# EAGLE design cheetah_driver_2 (EAGLE 6.5.0)
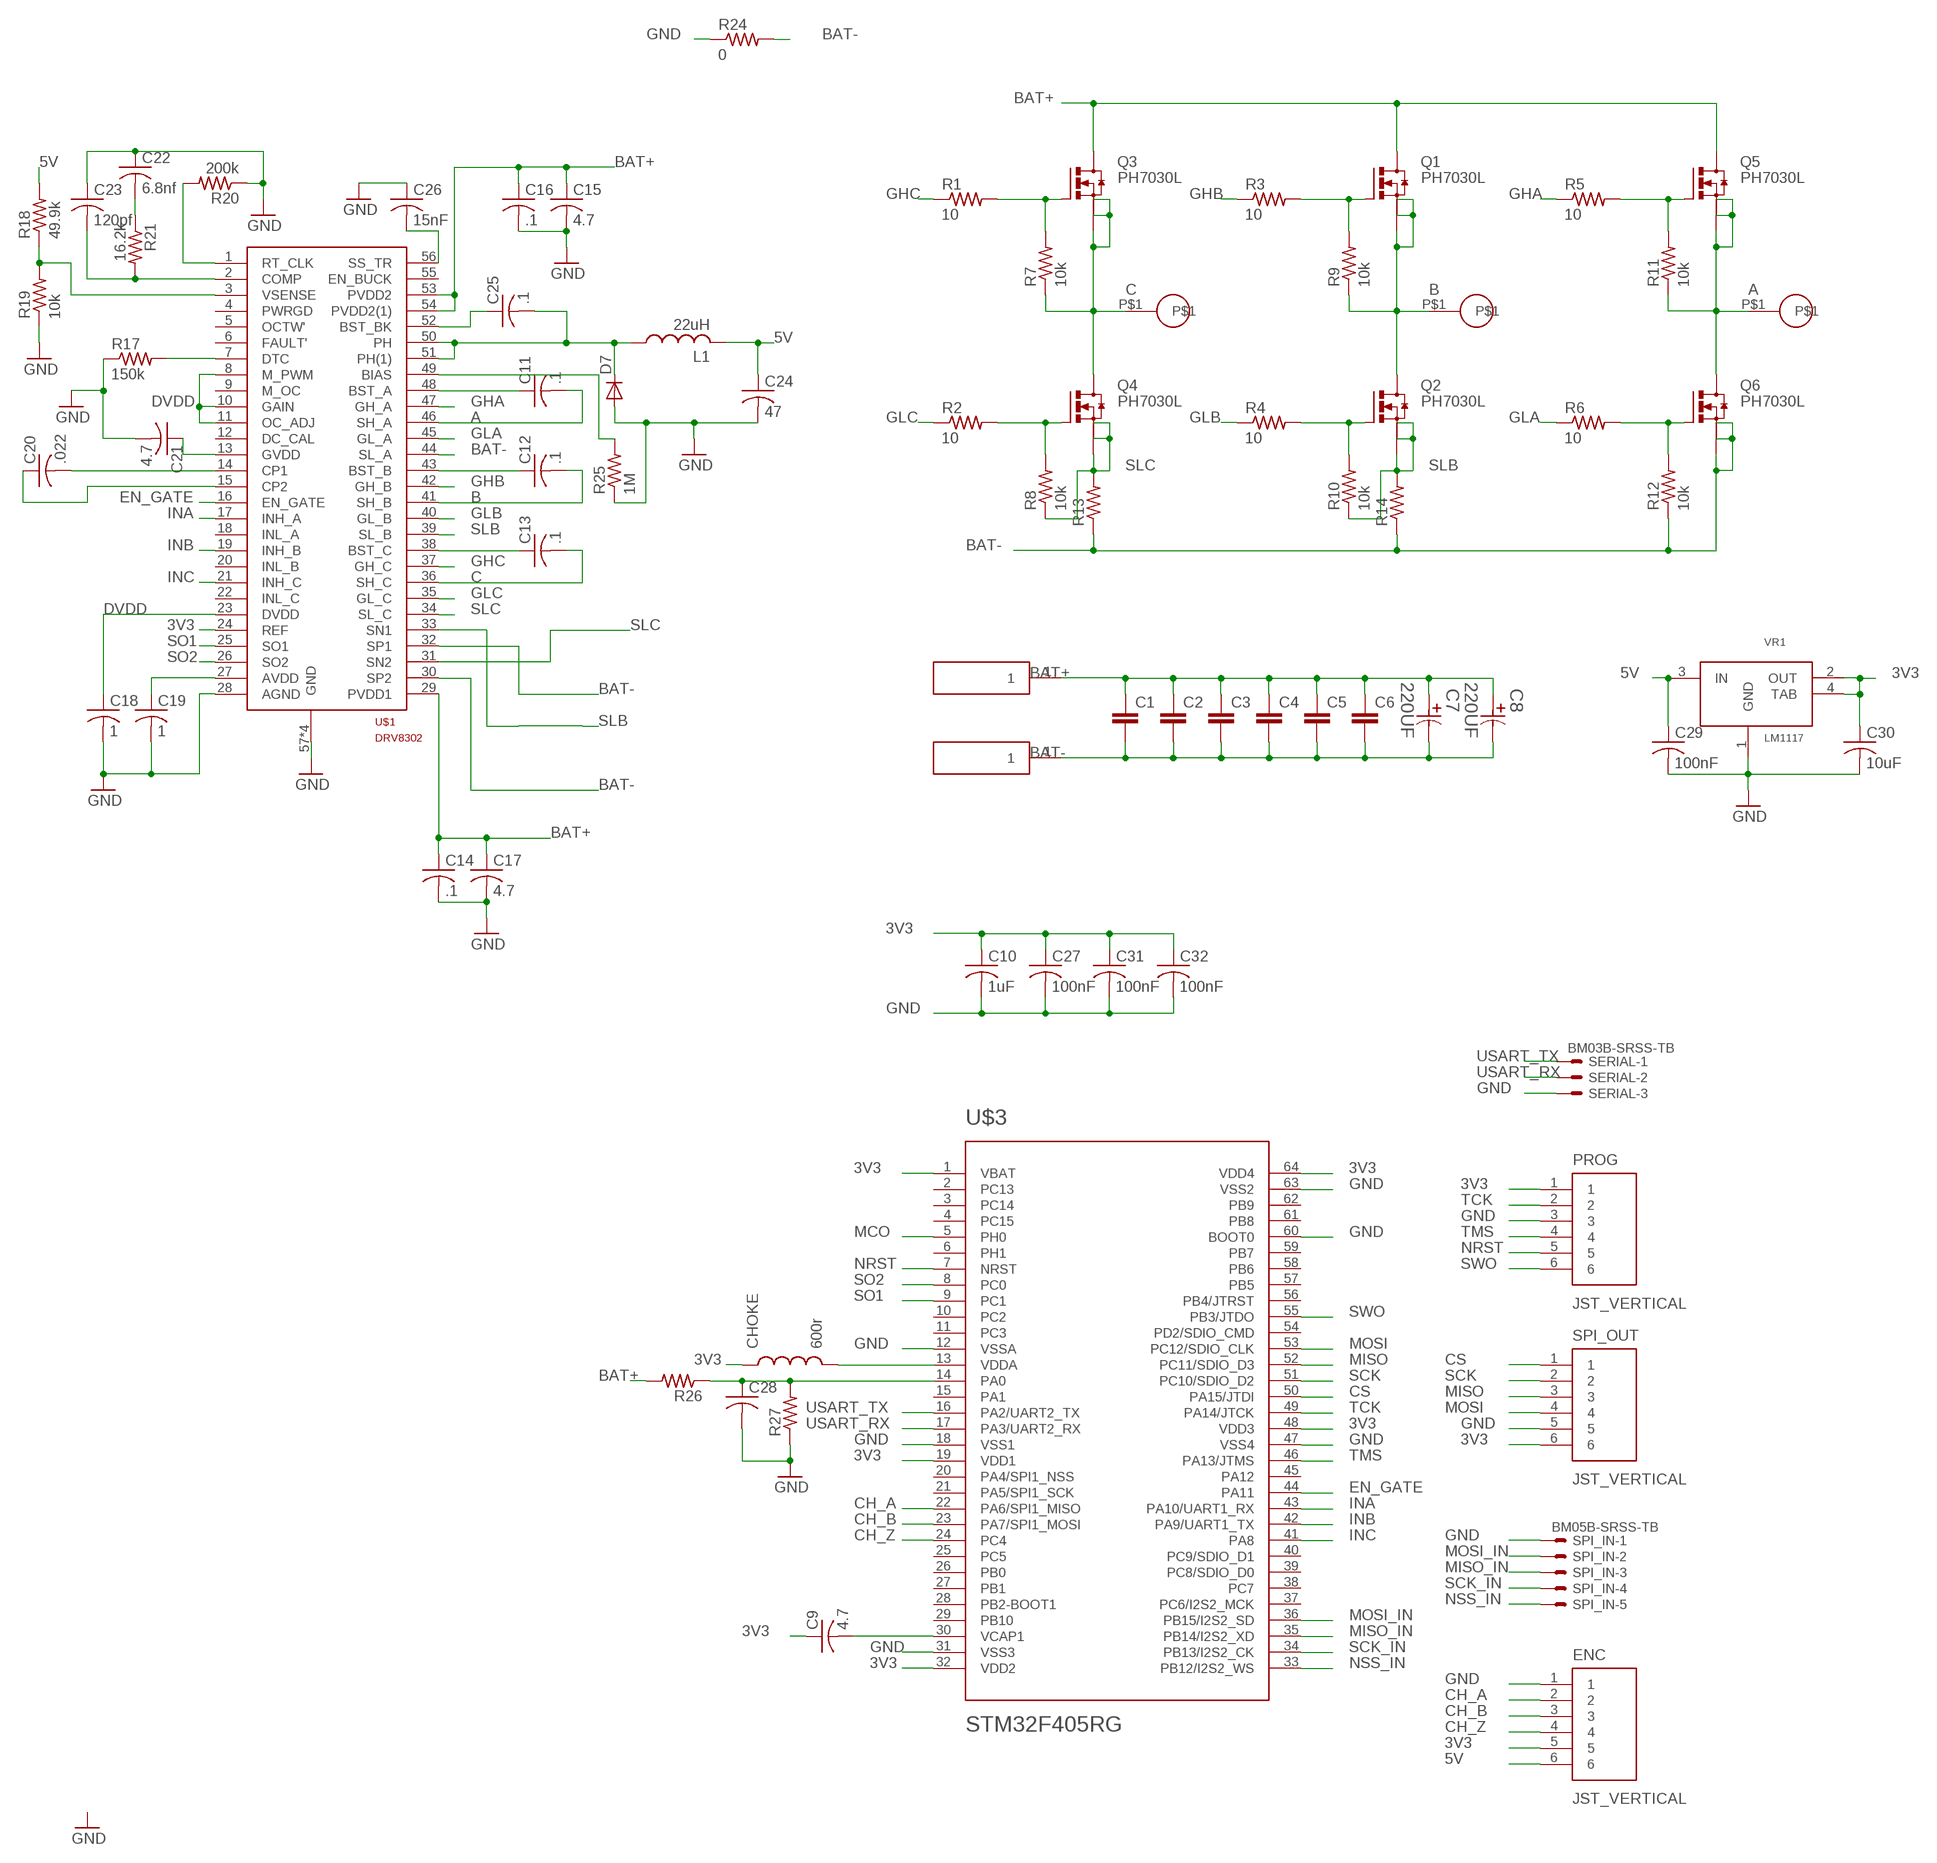
[diagram p0: schematic, sheet 1]

## Parts
C1  C-EUC0805  [C0805]
C2  C-EUC0805  [C0805]
C3  C-EUC0805  [C0805]
C4  C-EUC0805  [C0805]
C5  C-EUC0805  [C0805]
C6  C-EUC0805  [C0805]
C7  220UF  EEE-TK1A221P-CASE-F  [CAPAE830X1050N]
C8  220UF  EEE-TK1A221P-CASE-F  [CAPAE830X1050N]
C9  4.7  C-USC0603  [C0603]
C10  1uF  C-USC0603  [C0603]
C11  .1  C-USC0603  [C0603]
C12  .1  C-USC0603  [C0603]
C13  .1  C-USC0603  [C0603]
C14  .1  C-USC0603  [C0603]
C15  4.7  C-USC0805  [C0805]
C16  .1  C-USC0603  [C0603]
C17  4.7  C-USC0805  [C0805]
C18  1  C-USC0603  [C0603]
C19  1  C-USC0603  [C0603]
C20  .022  C-USC0603  [C0603]
C21  4.7  C-USC0805  [C0805]
C22  6.8nf  C-USC0603  [C0603]
C23  120pf  C-USC0603  [C0603]
C24  47  C-USC1210  [C1210]
C25  .1  C-USC0603  [C0603]
C26  15nF  C-USC0603  [C0603]
C27  100nF  C-USC0603  [C0603]
C28  C-USC0603  [C0603]
C29  100nF  C-USC0603  [C0603]
C30  10uF  C-USC0603  [C0603]
C31  100nF  C-USC0603  [C0603]
C32  100nF  C-USC0603  [C0603]
CHOKE  600r  INDUCTOR0603  [0603]
D7  DIODE-DO-214AC  [DO-214AC]
ENC  JST_VERTICAL  [JST-6-SMD-VERT-1.0MM]
J4  0.125_PAD  [0.125_PAD]
J5  0.125_PAD  [0.125_PAD]
L1  22uH  L-USL4532P  [L4532P]
PROG  JST_VERTICAL  [JST-6-SMD-VERT-1.0MM]
Q1  PH7030L  [SOT669]
Q2  PH7030L  [SOT669]
Q3  PH7030L  [SOT669]
Q4  PH7030L  [SOT669]
Q5  PH7030L  [SOT669]
Q6  PH7030L  [SOT669]
R1  10  R-US_R0603  [R0603]
R2  10  R-US_R0603  [R0603]
R3  10  R-US_R0603  [R0603]
R4  10  R-US_R0603  [R0603]
R5  10  R-US_R0603  [R0603]
R6  10  R-US_R0603  [R0603]
R7  10k  R-US_R0603  [R0603]
R8  10k  R-US_R0603  [R0603]
R9  10k  R-US_R0603  [R0603]
R10  10k  R-US_R0603  [R0603]
R11  10k  R-US_R0603  [R0603]
R12  10k  R-US_R0603  [R0603]
R13  R-US_R1210  [R1210]
R14  R-US_R1210  [R1210]
R17  150k  R-US_R0603  [R0603]
R18  49.9k  R-US_R0603  [R0603]
R19  10k  R-US_R0603  [R0603]
R20  200k  R-US_R0603  [R0603]
R21  16.2k  R-US_R0603  [R0603]
R24  0  R-US_R0603  [R0603]
R25  1M  R-US_R0603  [R0603]
R26  R-US_R0603  [R0603]
R27  R-US_R0603  [R0603]
SERIAL  BM03B-SRSS-TB  [BM03B-SRSS-TB]
SPI_IN  BM05B-SRSS-TB  [BM05B-SRSS-TB]
SPI_OUT  JST_VERTICAL  [JST-6-SMD-VERT-1.0MM]
U$1  DRV8302  [HTSSOP56]
U$2  18_AWG_PAD  [18_AWG_PAD]
U$3  STM32F405RG  [TQFP64]
U$4  18_AWG_PAD  [18_AWG_PAD]
U$5  18_AWG_PAD  [18_AWG_PAD]
VR1  LM1117  [SOT-223]

## Nets
3V3: C9.1 C10.1 C27.1 C30.1 C31.1 C32.1 CHOKE.1 ENC.5 PROG.1 SPI_OUT.6 U$1.24(REF) U$3.1(VBAT) U$3.19(VDD1) U$3.32(VDD2) U$3.48(VDD3) U$3.64(VDD4) VR1.2(OUT) VR1.4(TAB)
5V: C24.1 C29.1 ENC.6 L1.2 R18.2 VR1.3(IN)
A: C11.2 Q5.1(S) Q5.2(S) Q5.3(S) Q6.MB(D) R11.1 U$1.46(SH_A) U$5.P$1
B: C12.2 Q1.1(S) Q1.2(S) Q1.3(S) Q2.MB(D) R9.1 U$1.41(SH_B) U$4.P$1
BAT+: C1.1 C2.1 C3.1 C4.1 C5.1 C6.1 C7.1 C8.1 C14.1 C15.1 C16.1 C17.1 J4.1 Q1.MB(D) Q3.MB(D) Q5.MB(D) R26.2 U$1.29(PVDD1) U$1.53(PVDD2) U$1.54(PVDD2(1))
BAT-: C1.2 C2.2 C3.2 C4.2 C5.2 C6.2 C7.2 C8.2 J5.1 Q6.1(S) Q6.2(S) Q6.3(S) R12.1 R13.1 R14.1 R24.2 U$1.30(SP2) U$1.32(SP1) U$1.44(SL_A)
C: C13.2 Q3.1(S) Q3.2(S) Q3.3(S) Q4.MB(D) R7.1 U$1.36(SH_C) U$2.P$1
CH_A: ENC.2 U$3.22(PA6/SPI1_MISO)
CH_B: ENC.3 U$3.23(PA7/SPI1_MOSI)
CH_Z: ENC.4 U$3.24(PC4)
CS: SPI_OUT.1 U$3.50(PA15/JTDI)
DVDD: C18.1 U$1.8(M_PWM) U$1.10(GAIN) U$1.11(OC_ADJ) U$1.23(DVDD)
EN_GATE: U$1.16(EN_GATE) U$3.44(PA11)
GHA: R5.1 U$1.47(GH_A)
GHB: R3.1 U$1.42(GH_B)
GHC: R1.1 U$1.37(GH_C)
GLA: R6.1 U$1.45(GL_A)
GLB: R4.1 U$1.40(GL_B)
GLC: R2.1 U$1.35(GL_C)
GND: C10.2 C14.2 C15.2 C16.2 C17.2 C18.2 C19.2 C21.2 C22.1 C23.1 C24.2 C26.1 C27.2 C28.2 C29.2 C30.2 C31.2 C32.2 D7.A ENC.1 PROG.3 R17.1 R19.1 R20.1 R24.1 R25.1 R27.1 SERIAL.3 SPI_IN.1 SPI_OUT.5 U$1.28(AGND) U$1.57(GND) U$1.P$1(GND) U$1.P$2(GND) U$1.P$3(GND) U$3.12(VSSA) U$3.18(VSS1) U$3.31(VSS3) U$3.47(VSS4) U$3.60(BOOT0) U$3.63(VSS2) VR1.1(GND)
INA: U$1.17(INH_A) U$3.43(PA10/UART1_RX)
INB: U$1.19(INH_B) U$3.42(PA9/UART1_TX)
INC: U$1.21(INH_C) U$3.41(PA8)
MCO: U$3.5(PH0)
MISO: SPI_OUT.3 U$3.52(PC11/SDIO_D3)
MISO_IN: SPI_IN.3 U$3.35(PB14/I2S2_XD)
MOSI: SPI_OUT.4 U$3.53(PC12/SDIO_CLK)
MOSI_IN: SPI_IN.2 U$3.36(PB15/I2S2_SD)
N$1: Q3.4(G) R1.2 R7.2
N$2: CHOKE.2 U$3.13(VDDA)
N$3: C9.2 U$3.30(VCAP1)
N$4: C11.1 U$1.48(BST_A)
N$5: R25.2 U$1.49(BIAS)
N$6: C13.1 U$1.38(BST_C)
N$7: Q4.4(G) R2.2 R8.2
N$8: Q1.4(G) R3.2 R9.2
N$9: C12.1 U$1.43(BST_B)
N$10: Q5.4(G) R5.2 R11.2
N$11: Q6.4(G) R6.2 R12.2
N$12: R18.1 R19.2 U$1.3(VSENSE)
N$13: R17.2 U$1.7(DTC)
N$14: C19.1 U$1.27(AVDD)
N$15: C20.2 U$1.14(CP1)
N$16: C20.1 U$1.15(CP2)
N$17: C21.1 U$1.13(GVDD)
N$18: C23.2 R21.2 U$1.2(COMP)
N$19: R20.2 U$1.1(RT_CLK)
N$20: C22.2 R21.1
N$21: C25.2 D7.C L1.1 U$1.50(PH) U$1.51(PH(1))
N$22: C25.1 U$1.52(BST_BK)
N$23: C26.2 U$1.56(SS_TR)
N$24: C28.1 R26.1 R27.2 U$3.14(PA0)
N$27: Q2.4(G) R4.2 R10.2
NRST: PROG.5 U$3.7(NRST)
NSS_IN: SPI_IN.5 U$3.33(PB12/I2S2_WS)
SCK: SPI_OUT.2 U$3.51(PC10/SDIO_D2)
SCK_IN: SPI_IN.4 U$3.34(PB13/I2S2_CK)
SLB: Q2.1(S) Q2.2(S) Q2.3(S) R10.1 R14.2 U$1.33(SN1) U$1.39(SL_B)
SLC: Q4.1(S) Q4.2(S) Q4.3(S) R8.1 R13.2 U$1.31(SN2) U$1.34(SL_C)
SO1: U$1.25(SO1) U$3.9(PC1)
SO2: U$1.26(SO2) U$3.8(PC0)
SWO: PROG.6 U$3.55(PB3/JTDO)
TCK: PROG.2 U$3.49(PA14/JTCK)
TMS: PROG.4 U$3.46(PA13/JTMS)
USART_RX: SERIAL.2 U$3.17(PA3/UART2_RX)
USART_TX: SERIAL.1 U$3.16(PA2/UART2_TX)
Unconnected: U$1.4(PWRGD) U$1.5(OCTW') U$1.6(FAULT') U$1.9(M_OC) U$1.12(DC_CAL) U$1.18(INL_A) U$1.20(INL_B) U$1.22(INL_C) U$1.55(EN_BUCK) U$3.2(PC13) U$3.3(PC14) U$3.4(PC15) U$3.6(PH1) U$3.10(PC2) U$3.11(PC3) U$3.15(PA1) U$3.20(PA4/SPI1_NSS) U$3.21(PA5/SPI1_SCK) U$3.25(PC5) U$3.26(PB0) U$3.27(PB1) U$3.28(PB2-BOOT1) U$3.29(PB10) U$3.37(PC6/I2S2_MCK) U$3.38(PC7) U$3.39(PC8/SDIO_D0) U$3.40(PC9/SDIO_D1) U$3.45(PA12) U$3.54(PD2/SDIO_CMD) U$3.56(PB4/JTRST) U$3.57(PB5) U$3.58(PB6) U$3.59(PB7) U$3.61(PB8) U$3.62(PB9)

## Library data of the parts
C1-C6 = rcl:C-EU: CAPACITOR, European symbol
C7 C8 = Panasonic-EEEH_EEET_EEHZ_EEV:EEE-: Aluminum Electrolytic Capacitors,Surface Mount Type; MPN: EEE-TK1A221P; OC_FARNELL: 2079169; OC_NEWARK: 83T6947; PACKAGE: CASE-F; SUPPLIER: PANASONIC; TOLERANCE: ±20 %; VOLTAGERATING: 10V
C9-C32 = rcl:C-US: CAPACITOR, American symbol
CHOKE = SparkFun-Passives:INDUCTOR: Inductors Basic Inductor/Choke - 0603 and 1206. Footprints are not proven and vary greatly between part numbers. INDUCTOR POWER 3.3UH 4.0A SMD 0.197" L x 0.197" W x 0.177" H (5.00mm x 5.00mm x 4.50mm)
D7 = diode:DIODE-: DIODE
ENC PROG SPI_OUT = SparkFun-Connectors:JST_VERTICAL; PROD_ID: CONN-08249
J4 J5 = sc_usercreated:0.125_PAD
L1 = rcl:L-US: INDUCTOR, American symbol
Q1-Q6 = transistor-power:PH7030L: N-channel TrenchMOS (TM) logic level FET Source: http://www.nxp.com/acrobat_download/datasheets/PH7030L_4.pdf
R1-R14 R17-R21 R24-R27 = rcl:R-US_: RESISTOR, American symbol
SERIAL = con-jst2:?M03B-SRSS-TB: Disconnectable Crimp style connector, 1.0mm pitch 3 contacts
SPI_IN = con-jst2:?M05B-SRSS-TB: Disconnectable Crimp style connector, 1.0mm pitch 5 contacts
U$1 = ASL (1):DRV8302
U$2 U$4 U$5 = BenLibrary:18_AWG_PAD
U$3 = BenLibrary:STM32F405RG: ARM DSP Chip used on the WAV Trigger board.
VR1 = sc_usercreated:LM1117

## Board
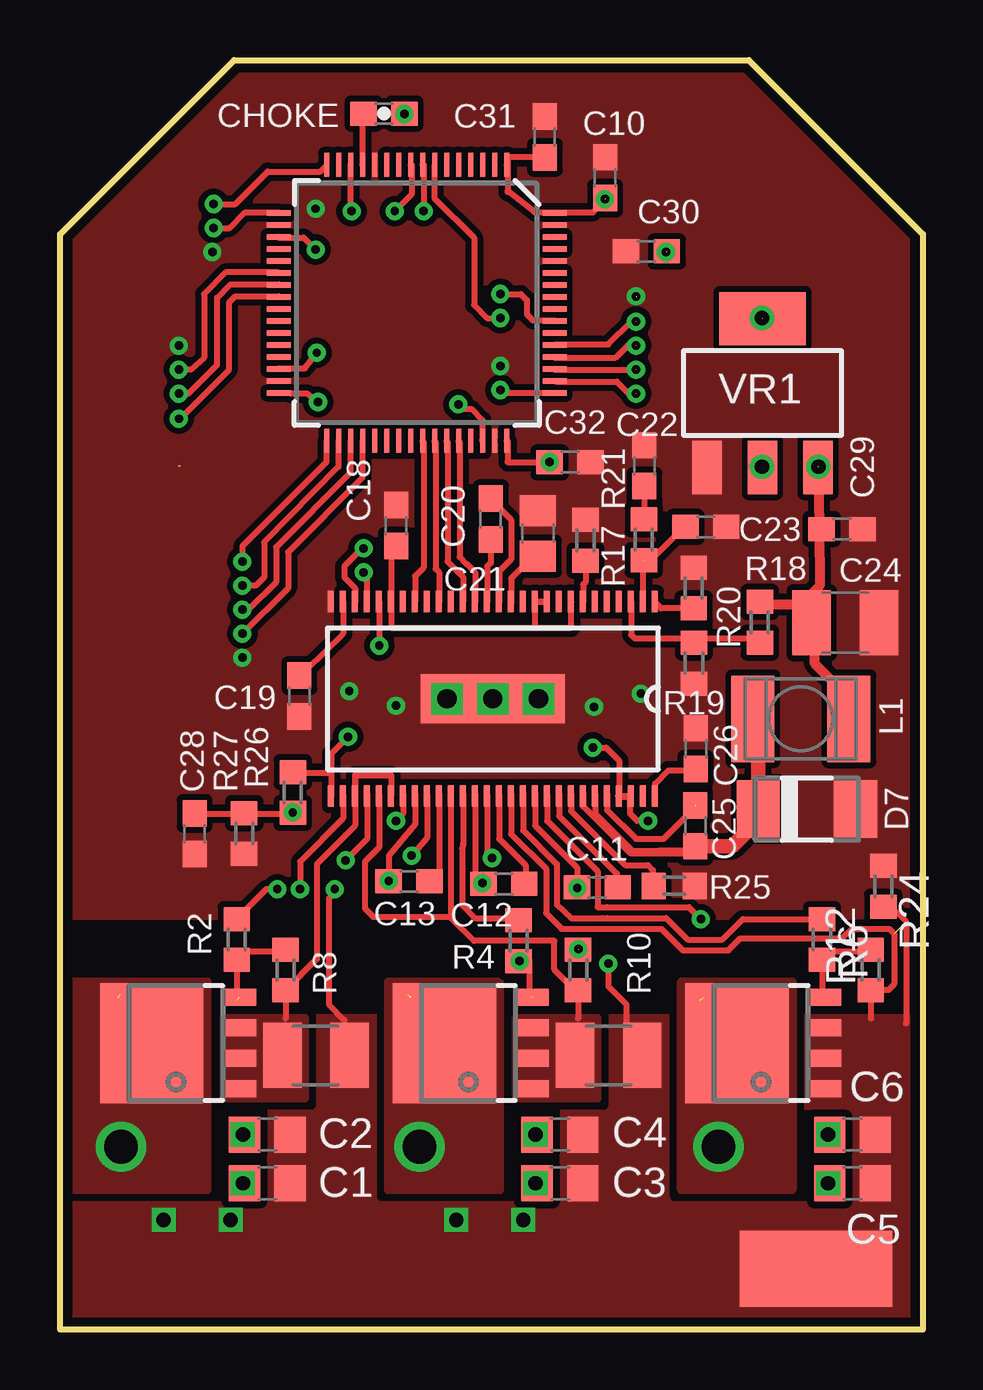
[diagram p1: board, top side]
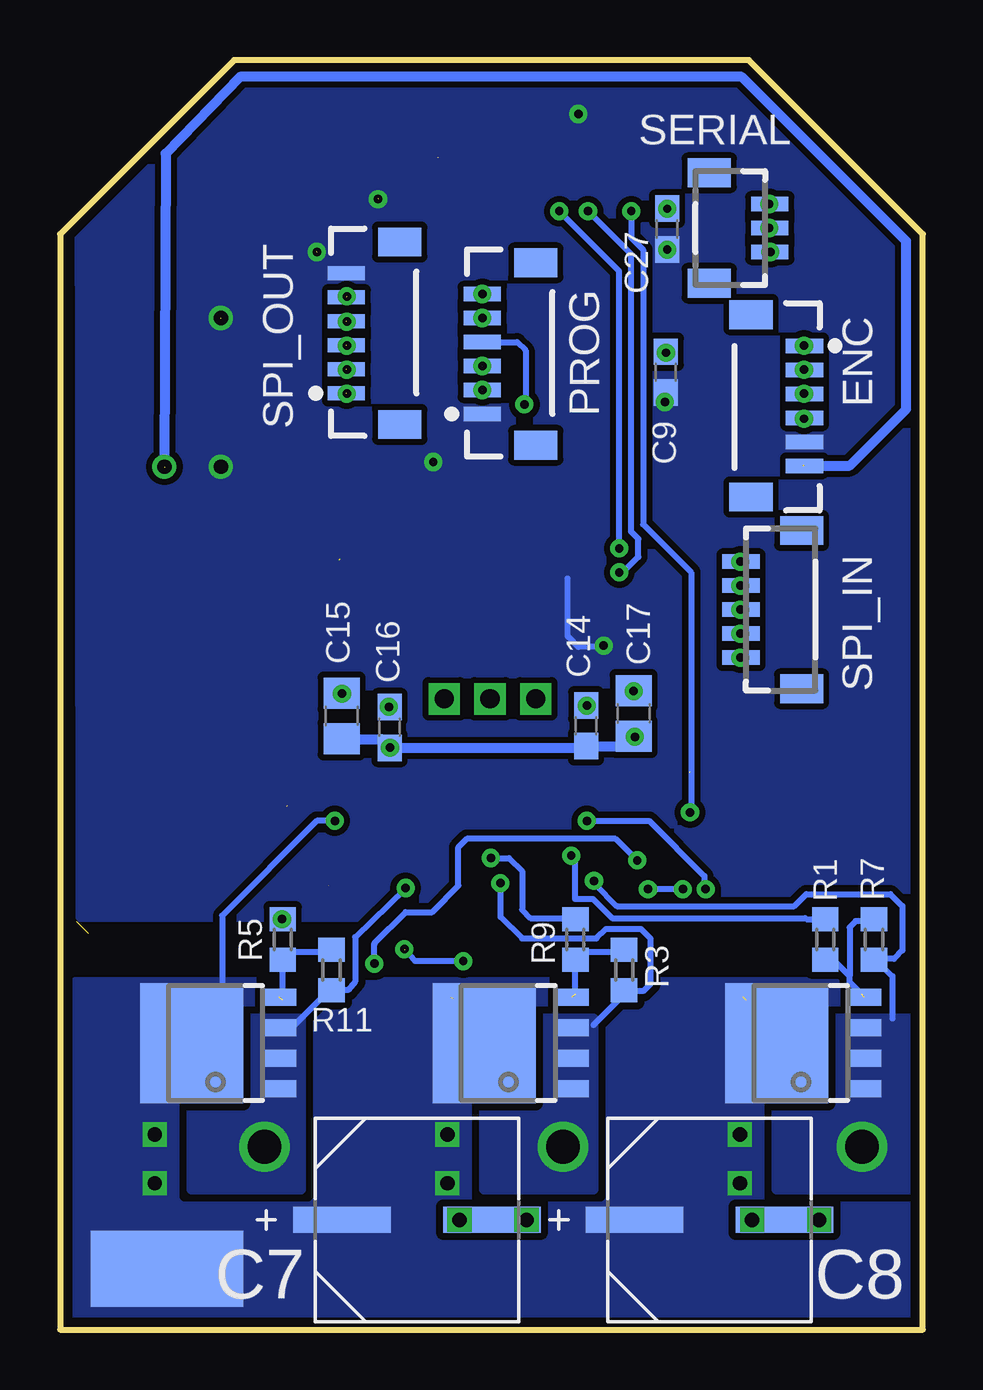
[diagram p2: board, bottom side, seen from below]

Size 35.95 x 52.9 mm. Coordinates in mm from the lower left corner, seen from the top.
Outline: 0,0 0,45.65 7.25,52.9 28.7,52.9 35.95,45.65 35.95,0 0,0
Copper layers (1*16): Top 0.035mm / dielectric 1.5mm / Bottom 0.035mm
Design rules "default *": minimum track width 6mil, minimum drill 24mil, track to track 6mil, track to pad 6mil, pad to pad 6mil, via to via 6mil, smd to smd 6mil, copper to edge 15mil, drill to drill 6mil, minimum pad ring 10mil, minimum via ring 8mil, stop-mask expansion 4mil, vias tented up to drill 0mil, thermal gap 10mil

### Footprints (pad centres in the part's own frame; a part is rotated, then mirrored left to right if it is on the bottom)
C0805 = smd 1.3 x 1.5: 1 -0.95,0; 2 0.95,0
CAPAE830X1050N = smd 4.064 x 1.092: 1 -3.124,0; 2 3.124,0
C0603 = smd 1.1 x 1: 1 -0.85,0; 2 0.85,0
C1210 = smd 1.6 x 2.7: 1 -1.4,0; 2 1.4,0
0603 = smd 1.1 x 1: 1 -0.85,0; 2 0.85,0
DO-214AC = smd 1.8 x 2.4: A 2.025,0; C -2.025,0
JST-6-SMD-VERT-1.0MM = smd 0.6 x 1.55: 1 -2.54,1.27; 2 -1.54,1.27; 3 -0.54,1.27; 4 0.46,1.27; 5 1.46,1.27; 6 2.46,1.27 | smd 1.2 x 1.8: P$1 -3.84,-0.955; P$2 3.76,-0.955
0.125_PAD = smd 6.35 x 3.175: 1 0,0
L4532P = smd 1.8 x 3.6: 1 -2,0; 2 2,0
SOT669 = smd 0.7 x 1.4: 1 -1.905,-2.65; 2 -0.635,-2.65; 3 0.635,-2.65; 4 1.905,-2.65 | smd 5 x 4.3: MB 0,1
R0603 = smd 1 x 1.1: 1 -0.85,0; 2 0.85,0
R1210 = smd 1.6 x 2.7: 1 -1.4,0; 2 1.4,0
BM03B-SRSS-TB = smd 0.6 x 1.55: 1 1,-1.625; 2 0,-1.625; 3 -1,-1.625 | smd 1.2 x 1.8: FIT@1 2.3,0.9; FIT@2 -2.3,0.9
BM05B-SRSS-TB = smd 0.6 x 1.55: 1 2,-1.625; 2 1,-1.625; 3 0,-1.625; 4 -1,-1.625; 5 -2,-1.625 | smd 1.2 x 1.8: FIT@1 3.3,0.9; FIT@2 -3.3,0.9
HTSSOP56 = smd 0.9 x 0.25: 1 -4.05,6.75; 2 -4.05,6.25; 3 -4.05,5.75; 4 -4.05,5.25; 5 -4.05,4.75; 6 -4.05,4.25; 7 -4.05,3.75; 8 -4.05,3.25; 9 -4.05,2.75; 10 -4.05,2.25; 11 -4.05,1.75; 12 -4.05,1.25; 13 -4.05,0.75; 14 -4.05,0.25; 15 -4.05,-0.25; 16 -4.05,-0.75; 17 -4.05,-1.25; 18 -4.05,-1.75; 19 -4.05,-2.25; 20 -4.05,-2.75; 21 -4.05,-3.25; 22 -4.05,-3.75; 23 -4.05,-4.25; 24 -4.05,-4.75; 25 -4.05,-5.25; 26 -4.05,-5.75; 27 -4.05,-6.25; 28 -4.05,-6.75; 29 4.05,-6.75; 30 4.05,-6.25; 31 4.05,-5.75; 32 4.05,-5.25; 33 4.05,-4.75; 34 4.05,-4.25; 35 4.05,-3.75; 36 4.05,-3.25; 37 4.05,-2.75; 38 4.05,-2.25; 39 4.05,-1.75; 40 4.05,-1.25; 41 4.05,-0.75; 42 4.05,-0.25; 43 4.05,0.25; 44 4.05,0.75; 45 4.05,1.25; 46 4.05,1.75; 47 4.05,2.25; 48 4.05,2.75; 49 4.05,3.25; 50 4.05,3.75; 51 4.05,4.25; 52 4.05,4.75; 53 4.05,5.25; 54 4.05,5.75; 55 4.05,6.25; 56 4.05,6.75 | smd 2.032 x 6: 57 0,0 | drill 0.8 square: P$1 0,0; P$2 0,1.905; P$3 0,-1.905
18_AWG_PAD = drill 1.4: P$1 0,0
TQFP64 = smd 0.22 x 1: 1 -3.75,-5.75; 2 -3.25,-5.75; 3 -2.75,-5.75; 4 -2.25,-5.75; 5 -1.75,-5.75; 6 -1.25,-5.75; 7 -0.75,-5.75; 8 -0.25,-5.75; 9 0.25,-5.75; 10 0.75,-5.75; 11 1.25,-5.75; 12 1.75,-5.75; 13 2.25,-5.75; 14 2.75,-5.75; 15 3.25,-5.75; 16 3.75,-5.75; 33 3.75,5.75; 34 3.25,5.75; 35 2.75,5.75; 36 2.25,5.75; 37 1.75,5.75; 38 1.25,5.75; 39 0.75,5.75; 40 0.25,5.75; 41 -0.25,5.75; 42 -0.75,5.75; 43 -1.25,5.75; 44 -1.75,5.75; 45 -2.25,5.75; 46 -2.75,5.75; 47 -3.25,5.75; 48 -3.75,5.75 | smd 1 x 0.22: 17 5.75,-3.75; 18 5.75,-3.25; 19 5.75,-2.75; 20 5.75,-2.25; 21 5.75,-1.75; 22 5.75,-1.25; 23 5.75,-0.75; 24 5.75,-0.25; 25 5.75,0.25; 26 5.75,0.75; 27 5.75,1.25; 28 5.75,1.75; 29 5.75,2.25; 30 5.75,2.75; 31 5.75,3.25; 32 5.75,3.75; 49 -5.75,3.75; 50 -5.75,3.25; 51 -5.75,2.75; 52 -5.75,2.25; 53 -5.75,1.75; 54 -5.75,1.25; 55 -5.75,0.75; 56 -5.75,0.25; 57 -5.75,-0.25; 58 -5.75,-0.75; 59 -5.75,-1.25; 60 -5.75,-1.75; 61 -5.75,-2.25; 62 -5.75,-2.75; 63 -5.75,-3.25; 64 -5.75,-3.75
SOT-223 = smd 1.219 x 2.235: 1 -2.311,-3.099; 2 0,-3.099; 3 2.311,-3.099 | smd 3.6 x 2.2: 4 0,3.099

### Placement (x,y rotation side)
C1  8.64,6.1 0 top
C2  8.64,8.13 0 top
C3  20.83,6.1 0 top
C4  20.83,8.13 0 top
C5  33.02,6.1 0 top
C6  33.02,8.13 0 top
C7  21.08,4.57 0 bottom
C8  8.89,4.57 0 bottom
C9  10.7,39.89 90 bottom
C10  22.71,48 90 top
C11  22.39,18.43 180 top
C12  18.49,18.58 180 top
C13  14.54,18.68 180 top
C14  14.03,25.16 90 bottom
C15  24.21,25.57 90 bottom
C16  22.22,25.09 90 bottom
C17  12.05,25.67 90 bottom
C18  14.01,33.5 90 top
C19  9.97,26.4 270 top
C20  17.95,33.77 90 top
C21  19.91,33.17 90 top
C22  24.35,36 270 top
C23  26.91,33.45 180 top
C24  32.72,29.45 0 top
C25  26.47,20.99 270 top
C26  26.49,24.21 270 top
C27  10.66,45.86 90 bottom
C28  5.61,20.66 270 top
C29  32.58,33.35 0 top
C30  24.43,44.93 180 top
C31  20.2,49.69 90 top
C32  21.25,36.14 0 top
CHOKE  13.5,50.67 180 top
D7  31.12,21.68 0 top
ENC  6.2,38.45 270 bottom
J4  31.5,2.54 180 bottom
J5  31.5,2.54 180 top
L1  30.87,25.44 0 top
PROG  17.08,40.69 90 bottom
Q1  17.27,11.94 90 bottom
Q2  17.02,11.94 90 top
Q3  5.08,11.94 90 bottom
Q4  4.83,11.94 90 top
Q5  29.46,11.94 90 bottom
Q6  29.21,11.94 90 top
R1  4.06,16.26 270 bottom
R2  7.37,16.26 270 top
R3  14.48,16.26 270 bottom
R4  19.11,16.21 270 top
R5  26.67,16.26 270 bottom
R6  31.75,16.26 270 top
R7  2.03,16.26 90 bottom
R8  9.4,14.99 90 top
R9  12.45,14.99 90 bottom
R10  21.59,14.99 90 top
R11  24.64,14.99 90 bottom
R12  33.78,14.99 90 top
R13  10.67,11.43 180 top
R14  22.86,11.43 180 top
R17  21.9,32.89 270 top
R18  29.16,29.47 90 top
R19  26.42,27.77 90 top
R20  26.41,30.9 270 top
R21  24.33,32.91 270 top
R24  34.31,18.48 270 top
R25  25.6,18.49 180 top
R26  9.71,22.38 90 top
R27  7.67,20.67 90 top
SERIAL  8,45.9 90 bottom
SPI_IN  5.95,30 270 bottom
SPI_OUT  22.75,41.55 90 bottom
U$1  18.03,26.28 270 top
U$2  2.54,7.62 0 top
U$3  14.86,42.78 180 top
U$4  14.99,7.62 0 top
U$5  27.43,7.62 0 top
VR1  29.27,39.02 0 top

### Tracks (layer width: path | path; a pad name or v marks a point on that pad's centre or on a via)
3V3  (via drill 0.35, 0.6)  (5 unrouted)
  Top 0.25: U$3.32 9.6,39.03 9.6,39 | U$3.19 9.1,45.5 | U$3.1 18.65,48.53 18.65,48.55 | U$3.64 20.35,46.53 20.35,46.55 | U$1.24 13.3,30.33 13.3,30.3 | U$3.48 18.65,37.03 18.65,37 | VR1.2 29.25,35.92 v29.25,35.95 | CHOKE.1 v14.35,50.65
  Top 0.254: v22.7,47.1 22.2,46.55 20.35,46.55 19.8,46.55 18.65,47.45 | 18.65,37 18.65,36.15 v20.4,36.15 | 18.65,47.45 18.65,48.55 18.65,48.85 C31.1 | 18.65,47.45 18.65,47.4 | 13.3,30.3 v13.3,28.5 | 9.1,45.5 10.15,45.5 v10.65,45 | v10.75,38.65 10.3,39 9.6,39
  Bottom 0.254: 13.3,28.45 14.35,28.45 14.8,28.9 14.8,31.3
  other vias: 29.25,42.15 25.25,44.9
  pour Bottom (isolate 0.254, no thermals): 0.65,52.25 35.15,52.25 35.1,17.2 0.6,17.2
5V  (2 unrouted)
  Top 0.25: 32.85,25.75 32.87,25.75 L1.2 | 31.45,29.6 31.32,29.6 C24.1 | 29.15,30.3 29.16,30.3 R18.2 | 31.6,35.9 31.58,35.9 VR1.3 | C29.1 31.63,33.35 31.63,33.4
  Top 0.406: 32.75,25.85 32.75,26.45 31.45,27.75 31.45,29.6 30.85,30.2 | 30.85,30.2 29.25,30.2 29.15,30.3 | 31.6,35.9 31.63,33.4 31.65,31 30.85,30.2
  Top 0.61: 32.75,25.85 32.85,25.75
  Bottom 0.406: 5,36 3.05,36 0.7,38.35 0.7,45.35 7.55,52.2 28.45,52.2 31.55,49 31.6,35.95
A  (via drill 0.35)
  Top 0.25: 19.8,22.4 19.78,22.4 U$1.46 | C11.2 v21.55,18.4
  Top 0.254: 19.8,22.4 19.8,21 21.55,19.25 v21.55,18.4
  Bottom 0.25: 24.64,14.22 R11.1
  Bottom 0.254: 24.64,14.22 26.16,12.7 | v21.55,18.4 23.65,16.35 23.65,14.5 23.95,14.15 R11.1
  pour Top (isolate 0.305, rank 2, no thermals): 30.48,14.48 30.48,5.84 25.91,5.84 25.91,14.48
  pour Bottom (isolate 0.305, no thermals): 25.91,12.95 30.48,12.95 30.48,5.84 25.91,5.84
B  (via drill 0.35)
  Top 0.25: U$1.41 17.3,22.23 17.3,22.2 | 17.6,18.55 v17.6,18.6 17.64,18.6 C12.2
  Top 0.254: 17.3,22.35 17.3,22.2 17.3,18.85 17.6,18.55
  Bottom 0.25: R9.1
  Bottom 0.254: 12.45,14.22 R9.1 12.45,13.97 13.72,12.7 | v17.6,18.6 17.6,17.2 16.7,16.3 13.6,16.3 13.2,16.7 11.75,16.7 11.35,16.3 11.35,14.4 11.65,14.1 12.4,14.1 R9.1
  pour Top (isolate 0.305, rank 2, no thermals): 18.29,14.48 18.29,5.84 13.72,5.84 13.72,14.48
  pour Bottom (isolate 0.305, no thermals): 13.72,12.95 18.29,12.95 18.29,5.84 13.72,5.84
BAT+  (via drill 0.35, 0.6)  (1 unrouted)
  Top 0.25: U$1.29 11.3,22.23 11.3,22.3 | U$1.53 23.25,22.23 23.25,22.25 23.78,22.25 | 23.78,22.25 U$1.54 | 23.3,22.2 23.78,22.2 U$1.54 | 23.8,22.25 23.78,22.25 | 23.78,22.25 U$1.54 | C5.1 v32,6.1 | v32,8.13 C6.1 | v19.81,8.13 C4.1 | v19.81,6.1 C3.1 | v7.62,8.13 C2.1 | v7.62,6.1 C1.1
  Top 0.254: 23.8,22.2 23.3,22.2 23.3,23.7 22.75,24.25 v22.2,24.25 | v24.5,21.2 24.05,21.2 23.75,21.5 23.75,22.2 23.8,22.25 | v12,24.7 11.3,24 11.3,23.2 | 11.3,23.2 11.3,22.3 11.3,22.2 | 9.7,23.2 11.3,23.2
  Bottom 0.25: v12,24.7 12.05,24.7 C17.1 12.05,24.7 | 14,24.25 14.03,24.25 C14.1 | v22.2,24.25 C16.1 | 24.2,24.6 24.21,24.6 C15.1
  Bottom 0.254: v24.5,21.2 25.25,21.2 29.2,17.25 29.2,14.35
  Bottom 0.406: 24.2,24.6 22.55,24.6 v22.2,24.25 14,24.25 13.95,24.3 12.45,24.3 12.05,24.7
  pour Bottom (isolate 0.305, rank 2, no thermals): 0.25,14.48 35.31,14.48 35.31,0 0.25,0.25
BAT-  (via drill 0.35, 0.6)  (1 unrouted)
  Top 0.25: 11.8,22.3 11.78,22.3 U$1.30 | 12.8,22.35 12.78,22.35 U$1.32 | U$1.44 18.8,22.23 18.8,22.3 | R12.1 | 34.3,17.65 34.31,17.65 R24.2
  Top 0.254: 33.78,14.22 R12.1 | R12.1 33.78,12.95 | 18.8,22.35 18.8,22.3 18.8,20.65 20.25,19.2 20.25,17.35 20.9,16.7 25.05,16.7 25.95,15.8 27.85,15.8 28.35,16.3 32.6,16.3 33,16.7 34.55,16.7 34.75,16.5 34.75,14.4 34.5,14.15 R12.1 | R12.1 33.75,14.15 | v22.85,15.25 22.85,14.3 23.6,13.55 23.6,12.75 | 12.8,22.35 12.8,20.45 v11.9,19.55 | 11.8,22.3 11.8,21.3 10,19.5 v10,18.35 | v11.45,18.35 11.45,18.2 11.2,17.95 11.2,13.55 11.85,12.9 | 34.3,17.65 34.6,17.65 35.25,17 35.25,12.75
  Bottom 0.25: C8.2 6.1,4.57 6.1,4.5 5.75,4.5 7.11,4.5 v7.11,4.57 | C7.2 v19.3,4.57
  Bottom 0.254: v22.85,15.25 22.85,16.05 22.85,16.1 21.55,17.4 20.45,17.4 19.35,18.5 19.35,20.1 19,20.45 12.8,20.45 v11.9,19.55 | v10,18.35 v11.45,18.35
  other vias: 4.32,4.57 16.51,4.57
  pour Top (isolate 0.305, rank 3, no thermals): 0.25,12.95 35.31,12.95 35.31,0.25 0.25,0.25
C  (via drill 0.35)
  Top 0.25: 14.8,22.35 14.78,22.35 U$1.36 | v13.7,18.7 v13.69,18.7 C13.2
  Top 0.254: 14.8,22.35 14.8,21.05 13.7,19.75 v13.7,18.7
  Bottom 0.25: R7.1 2.05,15.41 2.05,15.45 2.03,15.45 2.03,15.49
  Bottom 0.254: 2.03,15.49 1.27,14.73 1.27,12.95 | v13.7,18.7 13.65,18.55 12.75,17.65 5.35,17.65 4.85,18.15 1.35,18.15 0.85,17.65 0.85,15.8 1.2,15.45 2.05,15.45
  pour Top (isolate 0.305, rank 2, no thermals): 6.1,14.48 6.1,5.84 0.25,5.84 0.25,14.48
  pour Bottom (isolate 0.305, no thermals): 6.1,12.95 6.1,5.84 0.25,5.84 0.25,12.95
CH_A  (via drill 0.35)
  Top 0.25: 5.15,40 5.45,40 6,40.5 6,43.15 6.9,44.05 9.1,44.05 U$3.22 | 5.15,40 v4.95,40 5.15,40
  Bottom 0.25: ENC.2 v4.95,40 ENC.2 | ENC.2
CH_B  (via drill 0.35)
  Top 0.25: U$3.23 9.11,43.55 9.15,43.55 7.1,43.55 6.55,43 6.55,40.2 5.35,39 v4.95,39 ENC.3
  Bottom 0.25: ENC.3 v4.95,38.99 v4.95,39
CH_Z  (via drill 0.35)
  Top 0.25: U$3.24 9.11,43.05 9.15,43.05 7.3,43.05 7.05,42.8 7.05,40 5,37.95 v4.95,37.95 4.93,37.95 ENC.4
  Bottom 0.25: ENC.4 4.95,37.99 v4.95,37.95
CS  (via drill 0.35)  (1 unrouted)
  Top 0.25: v24,39 23.7,39 23.2,39.5 20.65,39.5 20.65,39.53 U$3.50
DVDD
  Top 0.25: 13.8,30.35 13.78,30.35 U$1.23 | C18.1 13.8,32.65 13.8,32.6 | U$1.10 U$1.11 19.8,30.33 19.8,30.3 | U$1.8 21.3,30.33 21.3,30.3
  Top 0.254: 13.8,30.35 13.8,30.3 | 13.8,30.3 13.8,29.25 19.8,29.25 | 19.8,29.25 19.8,30.3 19.8,30.35 20.3,30.35 | 19.8,29.25 21.3,29.25 21.3,30.3 21.3,30.35 | 13.8,32.6 13.8,30.35 | 13.8,30.35 13.8,30.3
EN_GATE
  Top 0.25: 16.65,37 16.61,37 U$3.44 | U$1.16 17.3,30.33 17.3,30.3
  Top 0.254: 16.65,37 16.65,32.2 16.95,31.9 17,31.85 17.3,31.55 17.3,30.3
GHA  (via drill 0.35)
  Top 0.25: 20.3,22.3 20.28,22.3 U$1.47
  Top 0.254: 20.3,22.3 20.3,21.2 22.4,19.1 22.4,17.6 22.8,17.6 26.2,17.6 v26.7,17.1
  Bottom 0.25: v26.7,17.1 R5.1
GHB  (via drill 0.35)
  Top 0.25: U$1.42 17.8,22.23 17.8,22.25
  Top 0.254: 17.8,22.3 17.8,22.25 17.8,19.9 v18,19.65
  Bottom 0.25: R3.1 14.5,17.11 14.5,17.15
  Bottom 0.254: v18,19.65 17.25,19.65 16.7,19.1 16.7,17.5 16.35,17.15 14.5,17.15
GHC  (via drill 0.35)
  Top 0.25: 15.3,22.3 15.28,22.3 U$1.37
  Top 0.254: 15.3,22.3 15.3,20.5 v14.65,19.75
  Bottom 0.25: 4.1,17.1 R1.1
  Bottom 0.254: v14.65,19.75 14.5,19.55 14.5,17.95 14.15,17.95 13.75,17.95 12.95,17.15 4.9,17.15 4.85,17.1 4.1,17.1
GLA
  Top 0.25: U$1.45 19.3,22.23 19.3,22.3 | R6.1
  Top 0.254: 19.3,22.4 19.3,22.3 19.3,20.8 20.7,19.4 20.7,17.7 21.3,17.15 22.6,17.15 22.8,17.15 25.25,17.15 26.15,16.25 27.6,16.25 28.45,17.1 31.55,17.1 R6.1 31.8,17.1
GLB
  Top 0.25: U$1.40 16.8,22.23 16.8,22.25 | 19.55,17.15 19.11,17.15 R4.1
  Top 0.254: 16.8,22.35 16.8,22.25 16.8,20.25 16.75,20.05 16.75,17.7 17.3,17.15 19.55,17.15
GLC  (via drill 0.35)
  Top 0.25: 14.3,22.35 14.28,22.35 U$1.35 | 7.35,17.1 R2.1
  Top 0.254: 14.3,22.35 14.3,21.5 v14,21.2 | v9.05,18.35 8.6,18.35 7.35,17.1
  Bottom 0.254: v14,21.2 11.4,21.2 9.1,18.9 9.1,18.4 v9.05,18.35
GND  (via drill 0.35)  (2 unrouted)
  Bottom 0.25: v4.95,41 ENC.1 | v6.35,44.9 SERIAL.3 | v10.65,46.7 C27.2 | SPI_IN.1 v7.6,28 7.6,27.95 | C17.2 v12.05,26.6 | C14.2 v14,26.01 v14,26 | v22.25,25.95 C16.2 | v24.2,26.5 24.21,26.5 C15.2
  other vias: 24,43.05 18.35,40.15
  pour Top (isolate 0.254, no thermals): 0.6,52.25 0.6,17.2 35.3,17.2 35.3,52.25
INA
  Top 0.25: 16.15,37 16.11,37 U$3.43 | U$1.17 16.8,30.33 16.8,30.35
  Top 0.254: 16.15,37 16.15,32 16.5,31.65 16.8,31.35 16.8,30.35
INB
  Top 0.25: 15.65,37 15.61,37 U$3.42 | 15.8,30.3 15.78,30.3 U$1.19
  Top 0.254: 15.65,37 15.65,31.7 15.8,31.55 15.8,30.3
INC
  Top 0.25: 15.15,37 15.11,37 U$3.41 | U$1.21 14.8,30.33 14.8,30.35
  Top 0.254: 15.15,37 15.15,31.75 14.8,31.4 14.8,30.35
MISO  (via drill 0.35)  (1 unrouted)
  Top 0.25: v24,41 23.65,41 23.15,40.5 20.6,40.5 20.61,40.5 U$3.52
MISO_IN  (via drill 0.35)
  Top 0.25: v7.6,30 7.85,30 9,31.15 9,32.6 12.1,35.7 12.1,37 12.11,37 U$3.35
  Bottom 0.25: v7.6,30 SPI_IN.3
MOSI  (via drill 0.35)  (1 unrouted)
  Top 0.25: v24,42 23.8,42 22.85,41.05 20.65,41.05 20.65,41.03 U$3.53
MOSI_IN  (via drill 0.35)
  Top 0.25: v7.6,29 9.5,30.9 9.5,32.4 12.6,35.5 12.6,37 12.61,37 U$3.36
  Bottom 0.25: v7.6,29 SPI_IN.2
N$1  (1 unrouted)
  Bottom 0.25: 2.03,17.02 R7.2 | 4.06,15.49 R1.2
  Bottom 0.254: 2.03,17.02 2.79,17.02 3.05,16.76 3.05,14.73 | 2.54,13.97 3.05,14.48 3.05,14.73 | 3.05,14.73 3.81,15.49 4.06,15.49
N$2
  Top 0.25: U$3.13 12.6,48.55 | CHOKE.2 12.6,50.67 12.6,50.65
  Top 0.254: 12.6,50.65 12.6,49.35 12.6,49.2 12.6,48.55 12.6,48.5
N$3  (via drill 0.35)
  Top 0.25: 9.1,40.05 9.11,40.05 U$3.30
  Top 0.254: 9.1,40.05 10.2,40.05 v10.7,40.7
  Bottom 0.25: C9.2 v10.7,40.7
N$4
  Top 0.25: U$1.48 20.8,22.23 20.8,22.25 | C11.1 23.2,18.43 23.2,18.45
  Top 0.254: 20.8,22.35 20.8,22.25 20.8,21.4 23.2,19 23.2,18.45
N$5  (1 unrouted)
  Top 0.25: U$1.49 21.3,22.23 21.3,22.3
  Top 0.254: 21.3,22.35 21.3,22.3 21.3,21.6 23.55,19.35 24.5,19.35 24.7,19.15 24.7,18.55 R25.2
N$6
  Top 0.25: 15.8,22.35 15.78,22.35 U$1.38 | 15.35,18.65 15.39,18.65 C13.1
  Top 0.254: 15.8,22.35 15.8,19.15 15.35,18.65
N$7  (1 unrouted)
  Top 0.25: R2.2 7.46,15.41 7.46,15.34 | R8.2 9.4,15.75
  Top 0.254: 9.4,15.75 7.87,15.75 7.46,15.34 7.37,15.24 7.37,13.72
N$8  (1 unrouted)
  Bottom 0.25: R9.2 12.45,15.75 | R3.2 14.48,15.55
  Bottom 0.254: 14.48,13.97 R3.2 14.48,15.55 14.48,15.75 12.45,15.75
N$9
  Top 0.25: 18.3,22.3 18.28,22.3 U$1.43 | C12.1 19.4,18.58 19.4,18.6
  Top 0.254: 18.3,22.3 18.3,20.45 19.4,19.35 19.4,18.6
N$10  (1 unrouted)
  Bottom 0.25: R11.2 24.64,15.75 | R5.2 26.67,15.45
  Bottom 0.254: 26.67,13.72 R5.2 26.67,15.45 26.67,15.49 26.67,15.75 24.64,15.75
N$11
  Top 0.25: 31.75,13.72 31.86,13.72 Q6.4 | 33.78,15.75 R12.2 | R6.2 31.75,15.55
  Top 0.254: 33.78,15.75 31.75,15.75 31.75,15.55 R6.2 31.75,13.72
N$12
  Top 0.25: U$1.3 23.8,30.33 23.8,30.35 | R19.2 26.35,28.62 26.35,28.8 | R18.1 29.15,28.6
  Top 0.254: 23.8,30.35 23.8,28.95 23.95,28.8 26.35,28.8 28.95,28.8 29.15,28.6
N$13
  Top 0.25: 21.8,30.3 21.78,30.3 U$1.7 | R17.2
  Top 0.254: R17.2 21.9,31.15 21.8,31.05 21.8,30.3
N$14
  Top 0.25: U$1.27 11.8,30.33 11.8,30.25 | 10,27.25 C19.1
  Top 0.254: 11.8,30.35 11.8,30.25 11.8,29 10.25,27.5 10,27.3 10,27.25
N$15
  Top 0.25: 18.3,30.3 18.28,30.3 U$1.14 | C20.2 17.95,34.6
  Top 0.254: 17.95,34.6 18.8,33.75 18.8,32.1 18.3,31.6 18.3,30.3
N$16
  Top 0.25: 17.8,30.3 17.78,30.3 U$1.15 | C20.1 17.95,32.9
  Top 0.254: 17.95,32.9 17.95,31.95 17.8,31.8 17.8,30.3
N$17
  Top 0.25: U$1.13 18.8,30.33 18.8,30.3 | C21.1 19.8,32.22 19.8,32.3
  Top 0.254: 19.9,32.4 19.8,32.3 18.8,31.3 18.8,30.3 18.8,30.25
N$18  (1 unrouted)
  Top 0.25: U$1.2 24.3,30.33 24.3,30.35 | C23.2 26,33.45
  Top 0.254: 24.3,30.35 24.3,32.1 24.65,32.1 26,33.45
N$19
  Top 0.25: U$1.1 24.8,30.33 24.8,30.3 | R20.2
  Top 0.254: R20.2 25.05,30.05 24.8,30.3
N$20
  Top 0.25: R21.1 24.3,33.76 24.3,33.75 | C22.2
  Top 0.254: C22.2 24.35,33.8 24.3,33.75
N$21
  Top 0.25: 29.1,25.5 28.87,25.5 L1.1 | U$1.50 21.8,22.23 21.8,22.3 | 22.3,22.35 22.28,22.35 U$1.51 | 23.85,19.95 23.85,19.85 | 26.45,20.15 C25.2 | D7.C 29.1,21.45
  Top 0.254: 22.3,22.35 22.3,21.5 23.85,19.95 26.05,20 26.45,20.15 | 21.8,22.4 21.8,22.3 21.8,21.8 23.75,19.85 23.85,19.85 26.55,19.85
  Top 0.61: 26.45,20.15 28,20.15 29.1,21.25 29.1,21.45 29.1,25.5 28.8,25.8
N$22  (1 unrouted)
  Top 0.25: 22.8,22.35 22.78,22.35 U$1.52
  Top 0.254: 22.8,22.35 22.8,21.65 24,20.45 25.15,20.45 26.5,21.8
N$23
  Top 0.25: 24.8,22.25 24.78,22.25 U$1.56 | C26.2
  Top 0.254: 24.8,22.25 24.8,22.75 25.35,23.3 26.45,23.3 C26.2
N$24  (via drill 0.35)
  Top 0.25: U$3.14 12.1,48.5 | C28.1 | R27.2 7.75,21.52 7.75,21.5 | 9.7,21.5 v9.7,21.55 v9.71,21.55 R26.1
  Top 0.254: C28.1 7.75,21.5 9.7,21.5 | 12.1,48.55 12.1,48.5 12.1,46.65 v12.15,46.6
  Bottom 0.254: v12.15,46.6 12.15,45.5 11.65,45 11.65,33.55 9.65,31.55 9.65,21.6 v9.7,21.55
N$26  (via drill 0.6)
  other vias: 31.6,35.95
N$27  (via drill 0.35)  (2 unrouted)
  Top 0.25: R4.2 v19.15,15.35 19.56,15.35 19.56,15.4
  Top 0.254: 19.56,15.4 19.56,13.82
  Bottom 0.254: v19.15,15.35 21.15,15.35 v21.6,15.85
NRST  (via drill 0.35)
  Top 0.25: PROG.5 17.8,42.15 17.25,42.7 17.25,45.5 15.6,47.15 15.6,48.5 U$3.7
  Bottom 0.25: PROG.5
  other vias: 18.35,42.15
NSS_IN  (via drill 0.35)
  Top 0.25: v7.6,32 7.6,32.65 11.1,36.15 11.1,37 U$3.33
  Bottom 0.25: v7.6,32 SPI_IN.5
SCK  (via drill 0.35)  (1 unrouted)
  Top 0.25: v24,40 20.6,40 U$3.51
SCK_IN  (via drill 0.35)
  Top 0.25: 11.6,37.05 11.6,37 | 11.6,37 11.6,35.95 8.5,32.8 8.5,31.35 8.15,31 v7.6,31 | U$3.34 11.6,37
  Bottom 0.25: v7.6,31 SPI_IN.4
SLB
  Top 0.25: 13.3,22.3 13.28,22.3 U$1.33 | U$1.39 16.3,22.23 16.3,22.25 | 21.59,14.22 R10.1
  Top 0.254: 21.59,14.22 R10.1 21.59,12.95 | R10.1 21.45,14.15 20.6,15 20.6,16.2 17.25,16.2 16.3,17.15 16.3,17.2 | 16.3,17.2 16.3,22.25 16.3,22.35 | 13.3,22.3 13.3,20.1 12.7,19.5 12.7,17.55 13.05,17.2 16.3,17.2
  pour Top (isolate 0.305, no thermals): 19.05,12.95 22.35,12.95 22.35,9.65 19.05,9.65
SLC
  Top 0.25: U$1.31 12.3,22.23 12.3,22.3 | 13.8,22.25 13.78,22.25 U$1.34 | 9.4,14.22 R8.1
  Top 0.254: 9.4,14.22 R8.1 9.4,12.95 | 12.3,22.55 12.3,23.1 | 12.3,23.1 12.3,22.55 | 12.3,22.55 12.3,22.45 | 12.3,22.45 12.3,22.55 | 12.3,22.55 12.3,23.1 | 12.3,23.1 13.8,23.1 13.8,22.25 | 12.3,22.45 12.3,22.3 12.3,21 11.9,20.6 10.7,19.4 10.7,15.45 R8.1
  pour Top (isolate 0.305, no thermals): 6.86,12.95 10.16,12.95 10.16,9.65 6.86,9.65
SO1  (via drill 0.35)
  Top 0.25: U$3.9 14.65,48.53 14.65,48.55 | 12.8,30.35 12.78,30.35 U$1.25
  Top 0.254: 12.8,30.35 12.8,31.4 v12.65,31.55 | 14.65,48.55 14.65,47.3 v13.95,46.6
  Bottom 0.254: v12.65,31.55 12.5,31.55 11.85,32.2 11.85,32.95 12.15,33.25 12.15,44.8 v13.95,46.6
SO2  (via drill 0.35)
  Top 0.25: 15.15,48.55 15.11,48.55 U$3.8 | U$1.26 12.3,30.33 12.3,30.35
  Top 0.254: v12.65,32.55 12.6,32.55 11.85,31.8 11.85,31.35 12.3,30.9 12.3,30.35 12.3,30.3 | 15.15,48.55 v15.15,46.6
  Bottom 0.254: v12.65,32.55 12.65,44.1 v15.15,46.6
SWO  (via drill 0.35)
  Top 0.25: PROG.6 19.2,43.15 19.45,42.9 19.45,42.3 19.7,42.05 20.6,42.05 U$3.55
  Bottom 0.25: PROG.6
  other vias: 18.35,43.15
TCK  (via drill 0.35)  (1 unrouted)
  Top 0.25: PROG.2 18.47,39.03 U$3.49
  other vias: 18.35,39.15
TMS  (via drill 0.35)
  Top 0.25: 17.6,37.8 17.6,37.75 | 17.6,37.75 17.6,37.1 | 17.6,37.1 17.6,37 | 17.6,37.75 17.6,37.9 17.15,38.35 16.7,38.35 v16.6,38.55 | U$3.46 17.6,37.1
  Bottom 0.25: v16.6,38.55 16.55,38.5 16.55,40.8 16.9,41.15 PROG.4
USART_RX  (via drill 0.35)
  Top 0.25: SERIAL.2 v6.4,45.9 7.05,45.9 7.7,46.55 9.1,46.55 9.11,46.55 U$3.17
  Bottom 0.25: SERIAL.2 v6.4,45.9
USART_TX  (via drill 0.35)
  Top 0.25: SERIAL.1 v6.4,46.9 7.3,46.9 8.65,48.25 10.85,48.25 11.1,48.5 11.11,48.5 U$3.16
  Bottom 0.25: SERIAL.1 v6.4,46.9